# Altium project ZX1541 Interfac in THT.PrjPcb
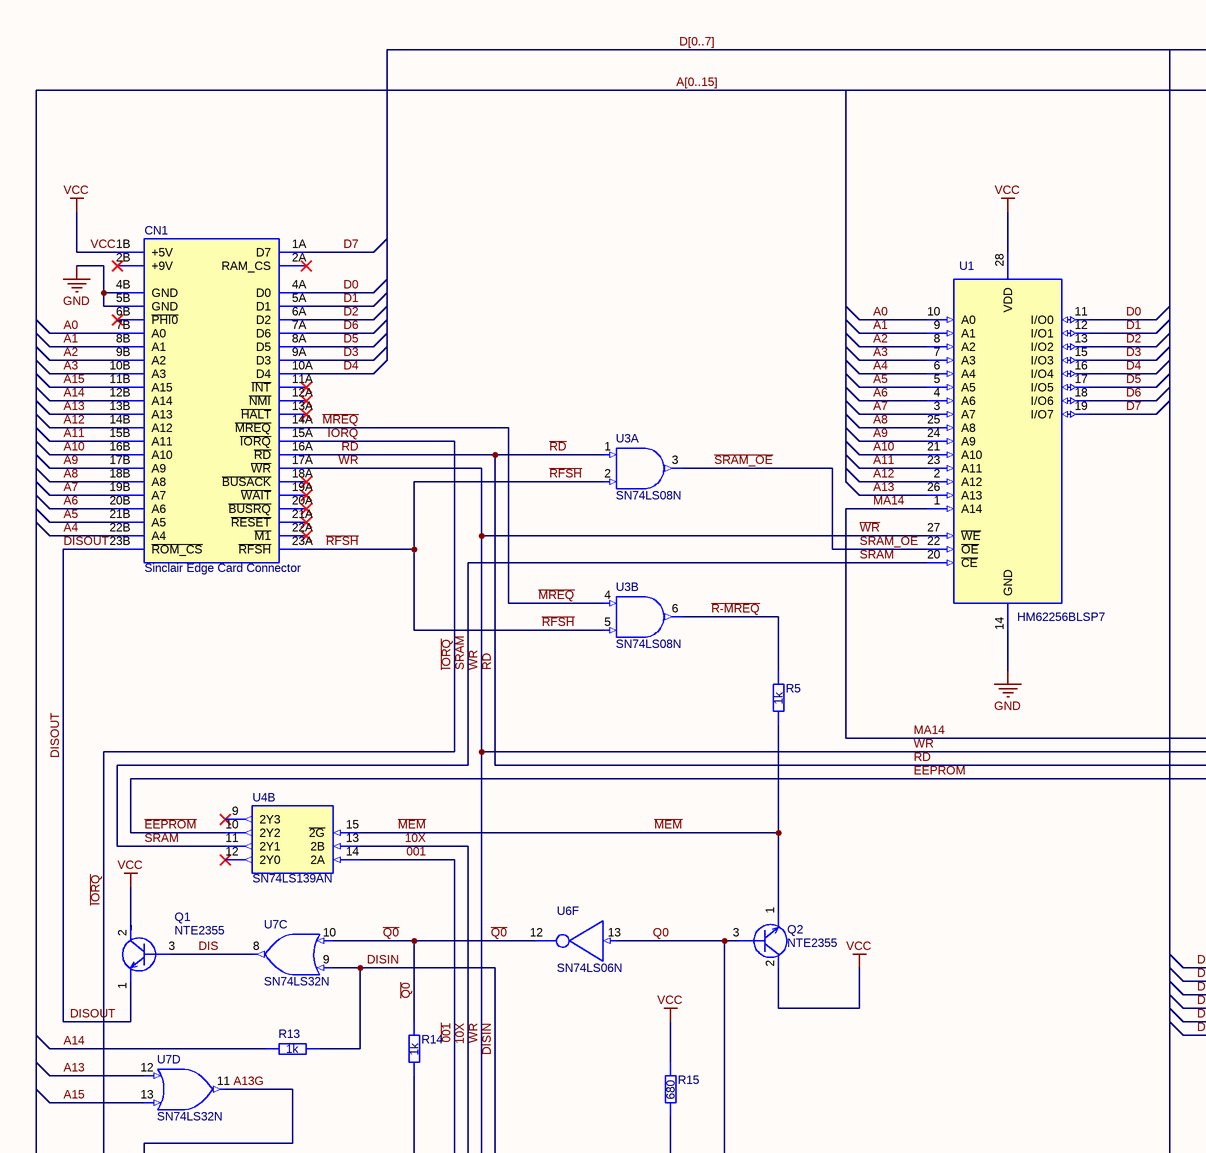
[diagram p0: ZX1541 Interfac in THT.SchDoc, top left]
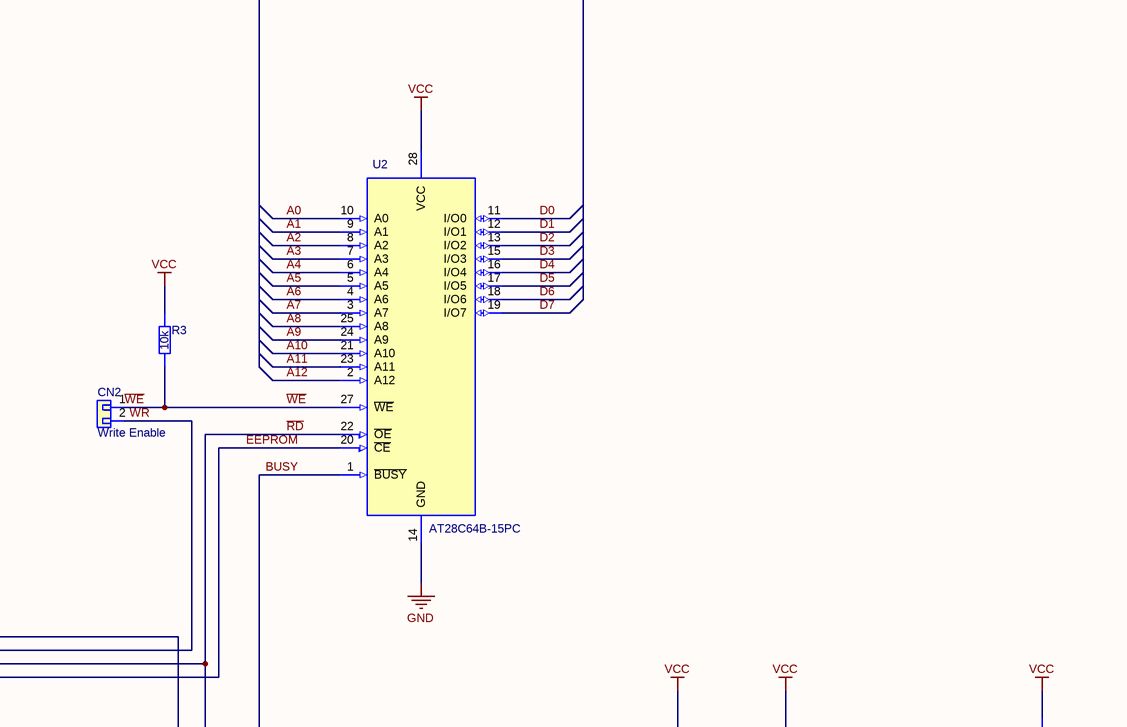
[diagram p1: ZX1541 Interfac in THT.SchDoc, top right]
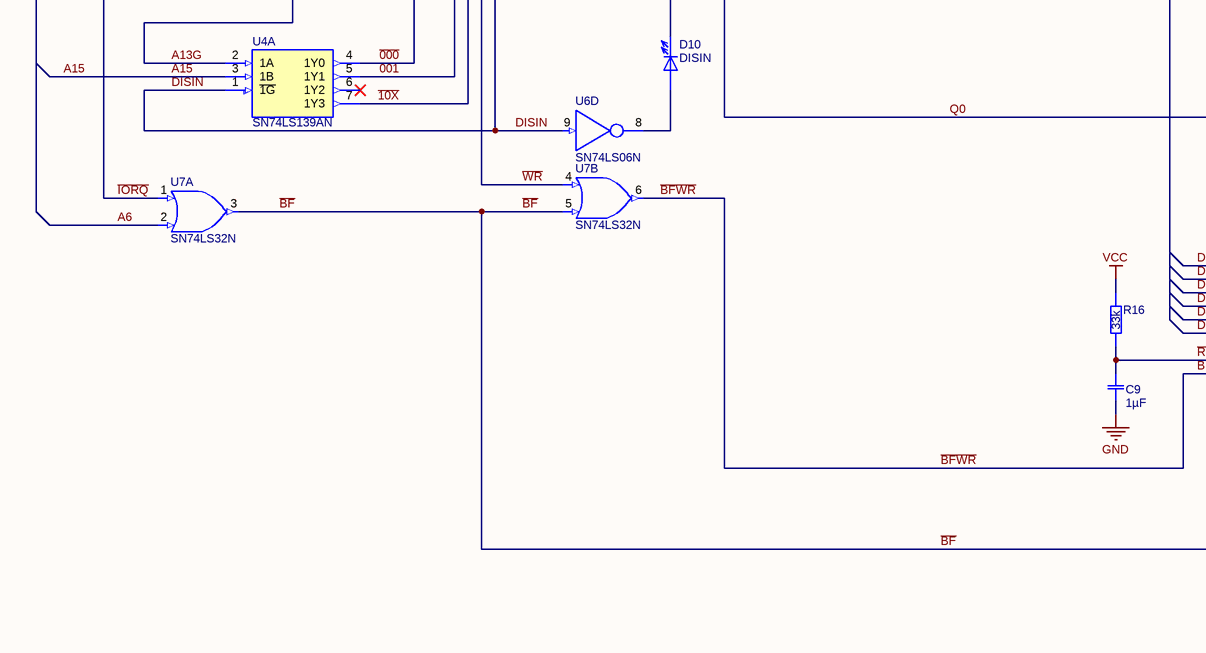
[diagram p2: ZX1541 Interfac in THT.SchDoc, bottom left]
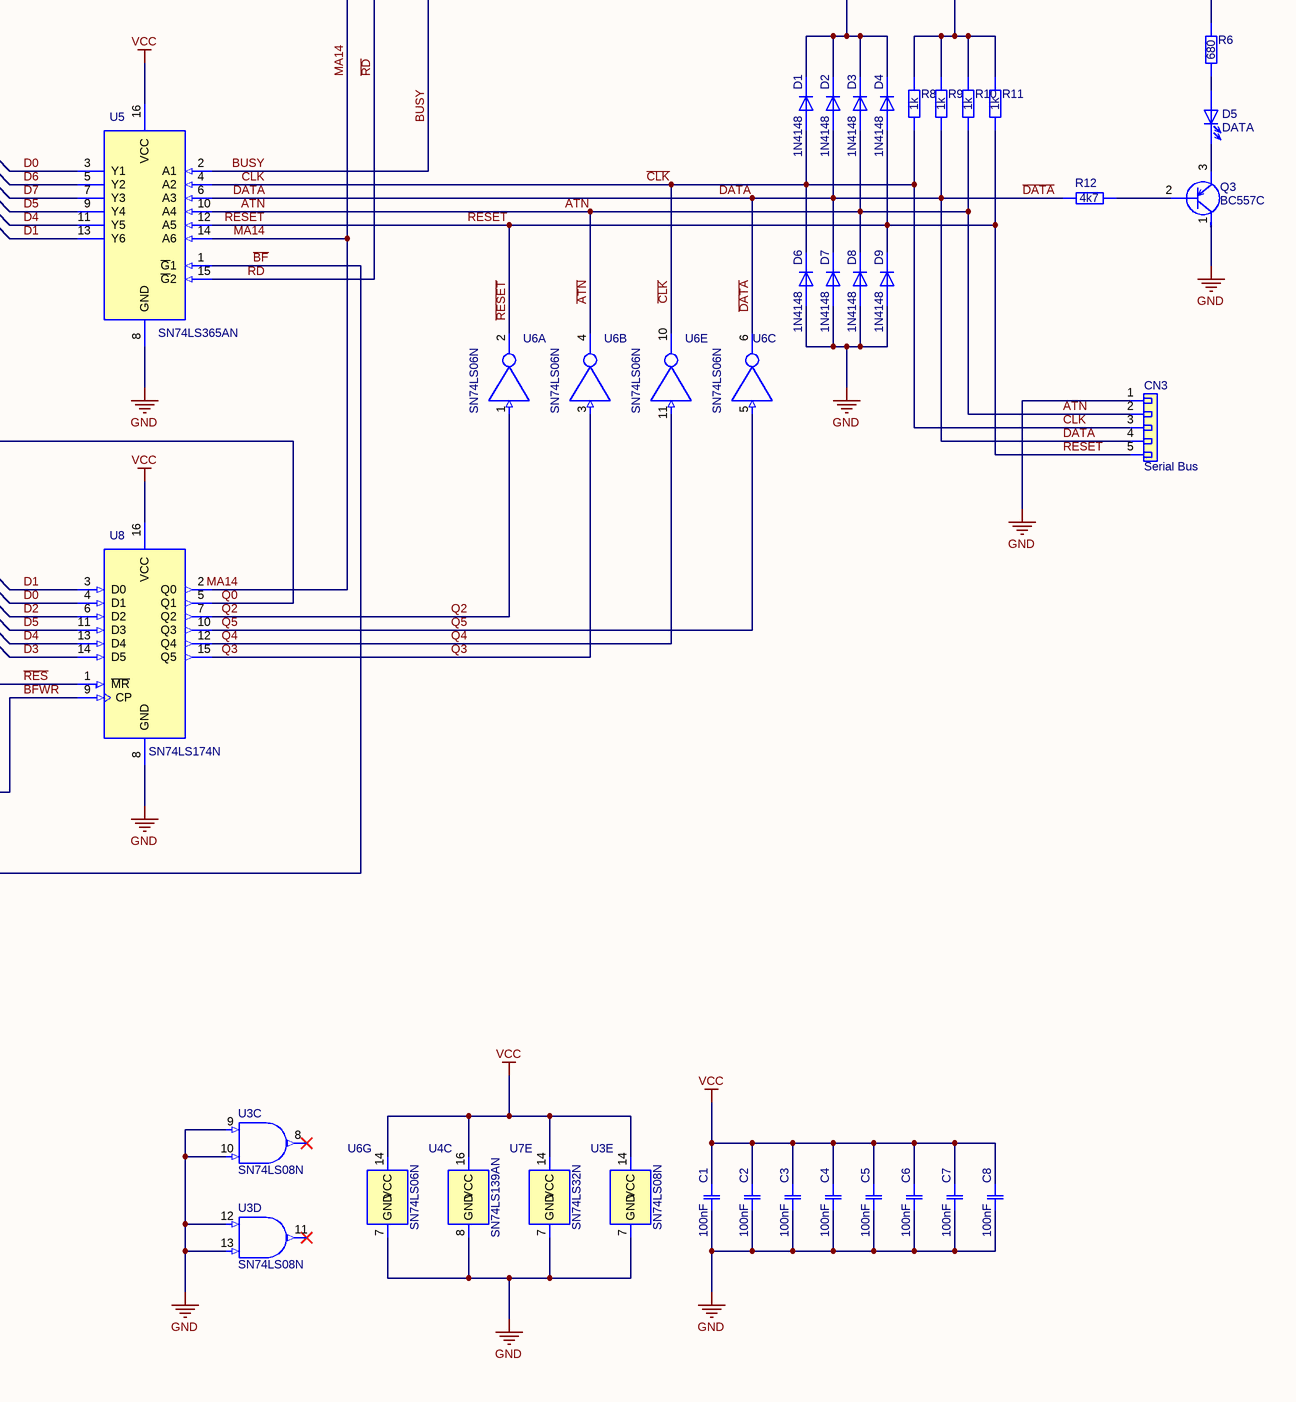
[diagram p3: ZX1541 Interfac in THT.SchDoc, bottom right]
Author: PCB-Tech; Revision: -; Title: Projektname; Version: 1.0
1 sheet, 45 parts. Net scope: global (net labels, ports and power ports of the same name join across sheets).
Board file: ZX1541 Interfac in THT.PcbDoc

## Sheet ZX1541 Interfac in THT.SchDoc: ZX1541 Interface in THT
size 594 x 420 mm; ApprovedBy: .; CheckedBy: .; Author: DiWou; CompanyName: DL2DW; DrawnBy: DiWou; Engineer: .; Organization: DL2DW; DocumentNumber: 1; Revision: -; SheetNumber: 1; SheetTotal: 1; DrawnDate: 11.10.2020; EngrDate: .; ChkdDate: .; Title1: ZX1541 Interface in THT; Title2: for Sinclair ZX-81; Title3: .; Desc1: Version 1.0; Desc2: .; ApprDate: .

### Parts
C1  100nF  [CAP Disc 100nF P2.54mm D5.5mm T3mm]
C2  100nF  [CAP Disc 100nF P2.54mm D5.5mm T3mm]
C3  100nF  [CAP Disc 100nF P2.54mm D5.5mm T3mm]
C4  100nF  [CAP Disc 100nF P2.54mm D5.5mm T3mm]
C5  100nF  [CAP Disc 100nF P2.54mm D5.5mm T3mm]
C6  100nF  [CAP Disc 100nF P2.54mm D5.5mm T3mm]
C7  100nF  [CAP Disc 100nF P2.54mm D5.5mm T3mm]
C8  100nF  [CAP Disc 100nF P2.54mm D5.5mm T3mm]
C9  1µF  [CAP 1µF C315C105K3R5TA P2.54mm]
CN1  Sinclair Edge Card Connector  [Sinclair Card Connector]
CN2  Write Enable  [Pin Header 01x02 2.54mm Horizontal Male]
CN3  Serial Bus  [01x05 RM2.0 mm Male Pin Header - MPE-Garry 150-1-005-0-S-XS0-0835]
D1  1N4148  [1N4148 P=5.08mm]
D2  1N4148  [1N4148 P=5.08mm]
D3  1N4148  [1N4148 P=5.08mm]
D4  1N4148  [1N4148 P=5.08mm]
D5  DATA  [LED 3mm Red Right Angle 4mm]
D6  1N4148  [1N4148 P=5.08mm]
D7  1N4148  [1N4148 P=5.08mm]
D8  1N4148  [1N4148 P=5.08mm]
D9  1N4148  [1N4148 P=5.08mm]
D10  DISIN  [LED 3mm Green Right Angle 4mm]
Q1  NTE2355  [NTE 2355]
Q2  NTE2355  [NTE 2355]
Q3  BC557C  [BC557C]
R3  10k  [10 kOhm R Axial DIN0207 L6.3mm D2.5mm P7.62mm Horizontal]
R5  1k  [1,0 kOhm R Axial DIN0207 L6.3mm D2.5mm P7.62mm Horizontal]
R6  680  [680 kOhm R Axial DIN0207 L6.3mm D2.5mm P7.62mm Horizontal]
R8  1k  [1,0 kOhm R Axial DIN0207 L6.3mm D2.5mm P7.62mm Horizontal]
R9  1k  [1,0 kOhm R Axial DIN0207 L6.3mm D2.5mm P7.62mm Horizontal]
R10  1k  [1,0 kOhm R Axial DIN0207 L6.3mm D2.5mm P7.62mm Horizontal]
R11  1k  [1,0 kOhm R Axial DIN0207 L6.3mm D2.5mm P7.62mm Horizontal]
R12  4k7  [4,7 kOhm R Axial DIN0207 L6.3mm D2.5mm P7.62mm Horizontal]
R13  1k  [1,0 kOhm R Axial DIN0207 L6.3mm D2.5mm P7.62mm Horizontal]
R14  1k  [1,0 kOhm R Axial DIN0207 L6.3mm D2.5mm P7.62mm Horizontal]
R15  680  [680 kOhm R Axial DIN0207 L6.3mm D2.5mm P7.62mm Horizontal]
R16  33k  [33 kOhm R Axial DIN0207 L6.3mm D2.5mm P7.62mm Horizontal]
U1  HM62256BLSP7  [Hitachi HM62256BLSP-7 SRAM 32kx8]
U2  AT28C64B-15PC  [28C64-150 with precision Socket]
U3  SN74LS08N  [SN74LS08N with Socket]  (parts A,B,C,D,E of 5)
U4  SN74LS139AN  [SN74LS139N with Socket]  (parts A,B,C of 3)
U5  SN74LS365AN  [SN74LS365A with Socket]
U6  SN74LS06N  [SN74LS06N with Socket]  (parts A,B,C,D,E,F,G of 7)
U7  SN74LS32N  [SN74LS32N with Socket]  (parts A,B,C,D,E of 5)
U8  SN74LS174N  [SN74LS174N with Socket]

### Nets
GND: C1.1 C2.1 C3.1 C4.1 C5.1 C6.1 C7.1 C8.1 C9.1 CN1.4B(GND) CN1.5B(GND) CN3.1 D6.2 D7.2 D8.2 D9.2 Q3.1 U1.14(GND) U2.14(GND) U3.7(GND) U3.9(3A) U3.10(3B) U3.12(4A) U3.13(4B) U4.8(GND) U5.8(GND) U6.7(GND) U7.7(GND) U8.8(GND)
VCC: C1.2 C2.2 C3.2 C4.2 C5.2 C6.2 C7.2 C8.2 CN1.1B(+5V) D1.1 D2.1 D3.1 D4.1 Q1.2 Q2.2 R3.2 R6.2 R8.2 R9.2 R10.2 R11.2 R15.2 R16.2 U1.28(VDD) U2.28(VCC) U3.14(VCC) U4.16(VCC) U5.16(VCC) U6.14(VCC) U7.14(VCC) U8.16(VCC)
~{000}: R14.1 U4.4(1Y0)
~{001}: U4.5(1Y1) U4.14(2A)
~{10X}: U4.7(1Y3) U4.13(2B)
A0: CN1.7B(A0) U1.10(A0) U2.10(A0)
A1: CN1.8B(A1) U1.9(A1) U2.9(A1)
A2: CN1.9B(A2) U1.8(A2) U2.8(A2)
A3: CN1.10B(A3) U1.7(A3) U2.7(A3)
A4: CN1.22B(A4) U1.6(A4) U2.6(A4)
A5: CN1.21B(A5) U1.5(A5) U2.5(A5)
A6: CN1.20B(A6) U1.4(A6) U2.4(A6) U7.2(1B)
A7: CN1.19B(A7) U1.3(A7) U2.3(A7)
A8: CN1.18B(A8) U1.25(A8) U2.25(A8)
A9: CN1.17B(A9) U1.24(A9) U2.24(A9)
A10: CN1.16B(A10) U1.21(A10) U2.21(A10)
A11: CN1.15B(A11) U1.23(A11) U2.23(A11)
A12: CN1.14B(A12) U1.2(A12) U2.2(A12)
A13: CN1.13B(A13) U1.26(A13) U7.12(4A)
A13G: U4.2(1A) U7.11(4Y)
A14: CN1.12B(A14) R13.1
A15: CN1.11B(A15) U4.3(1B) U7.13(4B)
~{ATN}: CN3.2 D3.2 D8.1 R10.1 U5.10(A4) U6.4(2Y)
~{BF}: U5.1(~{G}1) U7.3(1Y) U7.5(2B)
~{BFWR}: U7.6(2Y) U8.9(CP)
BUSY: U2.1(~{BUSY}) U5.2(A1)
~{CLK}: CN3.3 D1.2 D6.1 R8.1 U5.4(A2) U6.10(5Y)
D0: CN1.4A(D0) U1.11(I/O0) U2.11(I/O0) U5.3(Y1) U8.4(D1)
D1: CN1.5A(D1) U1.12(I/O1) U2.12(I/O1) U5.13(Y6) U8.3(D0)
D2: CN1.6A(D2) U1.13(I/O2) U2.13(I/O2) U8.6(D2)
D3: CN1.9A(D3) U1.15(I/O3) U2.15(I/O3) U8.14(D5)
D4: CN1.10A(D4) U1.16(I/O4) U2.16(I/O4) U5.11(Y5) U8.13(D4)
D5: CN1.8A(D5) U1.17(I/O5) U2.17(I/O5) U5.9(Y4) U8.11(D3)
D6: CN1.7A(D6) U1.18(I/O6) U2.18(I/O6) U5.5(Y2)
D7: CN1.1A(D7) U1.19(I/O7) U2.19(I/O7) U5.7(Y3)
~{DATA}: CN3.4 D2.2 D7.1 R9.1 R12.1 U5.6(A3) U6.6(3Y)
DIS: Q1.3 U7.8(3Y)
DISIN: R13.2 U4.1(~{1G}) U6.9(4A) U7.9(3A)
DISOUT: CN1.23B(~{ROM_CS}) Q1.1
~{EEPROM}: U2.20(~{CE}) U4.10(2Y2)
~{IORQ}: CN1.15A(~{IORQ}) U7.1(1A)
~{MEM}: Q2.1 R5.1 U4.15(~{2G})
~{MREQ}: CN1.14A(~{MREQ}) U3.4(2A)
MA14: U1.1(A14) U5.14(A6) U8.2(Q0)
Q0: Q2.3 U6.13(6A) U8.5(Q1)
Q2: U6.1(1A) U8.7(Q2)
Q3: U6.3(2A) U8.15(Q5)
Q4: U6.11(5A) U8.12(Q4)
Q5: U6.5(3A) U8.10(Q3)
~{Q0}: R14.2 U6.12(6Y) U7.10(3B)
~{R-MREQ}: R5.2 U3.6(2Y)
~{RD}: CN1.16A(~{RD}) U2.22(~{OE}) U3.1(1A) U5.15(~{G}2)
~{RES}: C9.2 R16.1 U8.1(~{MR})
~{RESET}: CN3.5 D4.2 D9.1 R11.1 U5.12(A5) U6.2(1Y)
~{RFSH}: CN1.23A(~{RFSH}) U3.2(1B) U3.5(2B)
~{SRAM}: U1.20(~{CE}) U4.11(2Y1)
~{SRAM_OE}: U1.22(~{OE}) U3.3(1Y)
~{WE}: CN2.1 R3.1 U2.27(~{WE})
~{WR}: CN1.17A(~{WR}) CN2.2 U1.27(~{WE}) U7.4(2A)
NetD5_1: D5.1 Q3.3
NetD5_2: D5.2 R6.1
NetD10_1: D10.1 R15.1
NetD10_2: D10.2 U6.8(4Y)
NetQ3_2: Q3.2 R12.2

Not connected (* = marked no-connect by the designer): CN1 2A(RAM_CS)* 2B(+9V)* 6B(~{PHI0})* 11A(~{INT})* 12A(~{NMI})* 13A(~{HALT})* 18A(~{BUSACK})* 19A(~{WAIT})* 20A(~{BUSRQ})* 21A(~{RESET})* 22A(~{M1})*; U2 26(N/C); U3 8(3Y)* 11(4Y)*; U4 6(1Y2)* 9(2Y3)* 12(2Y0)*

### Buses and harness runs
bus A[0..15]
bus D[0..7]

### Notes on the sheet
- Drawn by:
- Date
- Size:
- A2
- Rev:
- Engr:
- Chkd:
- Appr:
- File:
- Document No:
- Print Date & Time:
- /
- Sheet
- of

### Library data of the parts
C1-C8 = CMP-Capacitors-Ceramic_Capacitors-00007-4: Ceramic Disc Capacitors 100nF -20%~+80% 50V Through Hole,P=2.54mm RoHS; ComponentLink1URL: https://lcsc.com/product-detail/Others_Dersonic-CC1H104ZA1PD3F5O3000_C353909.html
C9 = CMP-Capacitors-Ceramic_Capacitors-00009-2: Multilayer Ceramic Capacitors MLCC - Leaded 25volts 1uF 10% X7R; Dissipation Factor: 3.5%; Temperature Coefficient: 2.2ppm/°C; Voltage: 25V; Lead Diameter: 0.51mm; Lead/Base Style: Straight; Height: 2.54mm; Package Quantity: 500; Max Operating Temperature: 125°C; Termination: Radial; Width: 0.1inch; Lead Pitch: 0.1inch; Min Operating Temperature: -55°C; Depth: 2.54mm; Height - Seated (Max): 0.21inch; Voltage Rating (DC): 25V; Length: 0.15inch; Voltage Rating: 25V; Case/Package: Radial; Tolerance: 10%; Dielectric: X7R; Capacitance: 1uF; Packaging: Bulk; Mount: Through Hole,PCB; Dielectric Material: Ceramic
CN1 = CMP-Connectors-00027-6
CN2 = CMP-Connectors-Male_PIN_Headers-00001-4: CONN HEADER .100" SNGL STR 2POS; Number of Positions: 2; Pitch: 0.1inch; Connector Type: Male Pin; Color: Black; Package Quantity: 1; Mount: Through Hole; Contact Plating: Gold; Contact Mating Length: 0.318inch; Termination: Solder; Number of Rows: 1; Packaging: Bulk
CN3 = CMP-Male_Pin_Headers-RM2.0_Male_Pin_Headers-00003-2: Conn Unshrouded Header HDR 5 POS 2mm Solder ST Thru-Hole Automotive Bulk; Gender: Male; Number of Contacts: 5; Max Voltage Rating (AC): 500V; Min Operating Temperature: -55°C; Lead Free: Lead Free; Housing Material: Polymer; Radiation Hardening: No; Max Operating Temperature: 125°C; Housing Color: Black; Termination: Solder; Contact Plating: Gold; Number of Rows: 1; Packaging: Bulk; Contact Material: Bronze; Pitch: 2mm; Depth: 1.97mm; Orientation: Straight; Length: 10mm
D1-D4 D6-D9 = CMP-Diodes-00002-4: NEXPERIA - 1N4148 - DIODE, 1N4148 AMMO-BOX 10K; Reverse Recovery Time: 4ns; Capacitance: 4pF; Element Configuration: Single; Current: 4A; Output Current: 200mA; Voltage Rating (DC): 100V; Max Power Dissipation: 500mW; Polarity: Standard; Forward Voltage: 1V; Weight: 0.01lb; Lead Free: Lead Free; Length: 2.5inch; Termination: Axial; Voltage: 100V; Forward Current: 200mA; Width: 0.25inch; Packaging: Ammo Pack; Max Repetitive Reverse Voltage (Vrrm): 100V; Max Operating Temperature: 200°C; Number of Pins: 2; Case/Package: SOD; Max Forward Surge Current (Ifsm): 4A; Height: 0.25inch; Peak Non-Repetitive Surge Current: 4A; Radiation Hardening: No; REACH SVHC: No SVHC; Current Rating: 200mA; Min Operating Temperature: -65°C
D5 = CMP-LEDs-00000-4: WURTH ELEKTRONIK   151033RS03000   LED, 3MM,  RED, 2600MCD, 621NM; Test Current: 20mA; Lens Style: Clear,Circular,Round; Forward Voltage: 2V; Viewing Angle: 30°; Forward Current: 30mA; Packaging: Bulk; Color: Red; Package Quantity: 1; Mount: Through Hole; Luminous Intensity: 2600mcd; Wavelength: 621nm; Lens Size: 3mm; Dominant Wavelength: 621nm; Case/Package: Radial; Min Operating Temperature: -40°C; REACH SVHC: Unknown; Max Operating Temperature: 85°C; Height: 5.55mm
D10 = CMP-LEDs-00007-1: WURTH ELEKTRONIK - 151033GS03000 - LED, Green, T-1 (3mm), 530 nm, 3.2 V, 30 mA, 15 cd RoHS Compliant: Yes; Forward Voltage: 3.2V; Luminous Intensity: 15000mcd; Lens Style: Clear,Round,Circular; Wavelength: 530nm; Viewing Angle: 30°; Forward Current: 30mA; Test Current: 20mA; Mount: Through Hole; Package Quantity: 1; Case/Package: Radial; Max Operating Temperature: 85°C; Color: Green; REACH SVHC: Unknown; Height: 5.55mm; Lens Size: 3mm; Min Operating Temperature: -40°C; Packaging: Bulk; Dominant Wavelength: 530nm
Q1 Q2 = CMP-Transistors-00009-1: PRE-BIASED DIG TRANSISTOR, 50V, TO-92; Transistor Polarity:NPN; Collector Emitter Voltage V(br)ceo:50V; Transition Frequency ft:250MHz; Power Dissipation Pd:300mW; DC Collector Current:100mA; DC Current Gain hFE:50; No. of Pins:3 ;RoHS Compliant: Yes; Power Dissipation: 300mW; Element Configuration: Single; Polarity: NPN; Transition Frequency: 250MHz; Max Collector Current: 200mA; Number of Pins: 3; Mount: Through Hole; Max Operating Temperature: 150°C; Weight: 0.016lb; Height: 0.5inch; REACH SVHC: No SVHC; Length: 6inch; Collector Emitter Breakdown Voltage: 50V; Width: 3inch; Collector Emitter Voltage (VCEO): 50V; Max Power Dissipation: 300mW; Min Operating Temperature: -55°C; Collector Base Voltage (VCBO): 50V; Case/Package: TO-92
Q3 = CMP-Transistors-00003-1: Trans GP BJT PNP 45V 0.1A Automotive 3-Pin TO-92 T/R; Number of Elements: 1; Frequency: 150MHz; Emitter Base Voltage (VEBO): 5V; Power Dissipation: 500mW; Collector Base Voltage (VCBO): 50V; Max Operating Temperature: 150°C; Case/Package: TO-92; Collector Emitter Voltage (VCEO): 45V; Packaging: Tape and Reel; Min Operating Temperature: -55°C; Polarity: PNP; Mount: Through Hole; Number of Pins: 3
R3 = CMP-Resistors-Yageo_THT_DIN_0207-00096-1: RES 10K OHM 1/4W 5% AXIAL; Resistance: 10kR; Temperature Coefficient: 500ppm/°C; Max Power Dissipation: 250mW; Case/Package: Axial; Number of Terminations: 2; Composition: Carbon Film; Packaging: Bulk; Min Operating Temperature: -55°C; Lead Free: Lead Free; Package Quantity: 200; Max Operating Temperature: 155°C; Length: 0.248inch; Tolerance: 5%
R5 R8-R11 R13 R14 = CMP-Resistors-Yageo_THT_DIN_0207-00072-1: RES 1K OHM 1/4W 5% AXIAL; Max Power Dissipation: 250mW; Resistance: 1kR; Temperature Coefficient: 500ppm/°C; Composition: Carbon Film; Lead Free: Lead Free; Case/Package: Axial; Packaging: Bulk; Length: 0.248inch; Min Operating Temperature: -55°C; Tolerance: 5%; Number of Terminations: 2; Package Quantity: 200; Max Operating Temperature: 155°C; Power Rating: 250mW
R6 R15 = CMP-Resistors-Yageo_THT_DIN_0207-00140-1: Res 680K Ohm 1/4W 5% Axial; Resistance: 680kR; Max Power Dissipation: 250mW; Temperature Coefficient: -700ppm/°C; Package Quantity: 200; Composition: Carbon Film; Max Operating Temperature: 155°C; Packaging: Bulk; Number of Terminations: 2; Min Operating Temperature: -55°C; Length: 0.248inch; Case/Package: Axial; Tolerance: 5%
R12 = CMP-Resistors-Yageo_THT_DIN_0207-00088-1: RES 4.7K OHM 1/4W 5% AXIAL; Resistance: 4.7kR; Max Power Dissipation: 250mW; Temperature Coefficient: 500ppm/°C; Length: 0.248inch; Number of Terminations: 2; Composition: Carbon Film; Packaging: Bulk; Max Operating Temperature: 155°C; Package Quantity: 200; Case/Package: Axial; Tolerance: 5%; Min Operating Temperature: -55°C; Power Rating: 250mW; Lead Free: Lead Free
R16 = CMP-Resistors-Yageo_THT_DIN_0207-00108-1: RES 33K OHM 1/4W 5% AXIAL; Temperature Coefficient: 500ppm/°C; Max Power Dissipation: 250mW; Resistance: 33kR; Max Operating Temperature: 155°C; Tolerance: 5%; Min Operating Temperature: -55°C; Package Quantity: 200; Case/Package: Axial; Packaging: Bulk; Number of Terminations: 2; Length: 0.248inch; Composition: Carbon Film
U1 = CMP-ICs-Memory-00014-1: Contact for details; Case/Package: PDIP
U2 = CMP-ICs-Memory-00010-3: IC EEPROM 64KBIT 150NS 28DIP; Memory Size: 64Kb; Interface: SPI,Parallel; Max Supply Voltage: 5.5V; Frequency: 150GHz; Min Supply Voltage: 4.5V; Nominal Supply Current: 40mA; Lead Free: Contains Lead; Packaging: Rail/Tube; Min Operating Temperature: 0°C; Density: 64Kb; Memory Type: EEPROM; Max Operating Temperature: 70°C; Number of Pins: 28; Mount: Through Hole; Package Quantity: 14; Case/Package: PDIP; Access Time: 150ns
U3 = CMP-ICs-74xx-series-00004-2: IC GATE AND 4CH 2-INP 14DIP; Low Level Output Current: 8mA; Number of Circuits: 4; Number of Outputs: 1; Schmitt Trigger Input: No; Quiescent Current: 4.4mA; Min Supply Voltage: 4.75V; Number of Input Lines: 2; High Level Output Current: -400uA; Max Supply Voltage: 5.25V; Turn-On Delay Time: 25ns; Operating Supply Voltage: 5V; Propagation Delay: 20ns; Lead Free: Lead Free; Number of Gates: 4; Termination: Through Hole; Height: 4.57mm; Number of Elements: 4; Width: 6.35mm; Logic Function: AND; Weight: 0.032734oz; Max Operating Temperature: 70°C; Number of Bits: 4; Number of Inputs: 2; Number of Output Lines: 1; Packaging: Rail/Tube; Case/Package: PDIP; Mount: Through Hole; Max Output Current: 8mA; Package Quantity: 25; Output Current: 8mA; REACH SVHC: No SVHC; Contact Plating: Gold; Radiation Hardening: No; Min Operating Temperature: 0°C; Length: 19.3mm; Number of Pins: 14
U4 = CMP-ICs-74xx-series-00043-5: TEXAS INSTRUMENTS         SN74LS139AN            IC, DECODER/DEMUX, 74LS139; Number of Input Lines: 2; Propagation Delay: 33ns; Polarity: Inverting; Max Supply Voltage: 5.25V; Bandwidth: 35MHz; Operating Supply Voltage: 5V; Number of Output Lines: 4; Low Level Output Current: 8mA; Max Power Dissipation: 200mW; Throw Configuration: DP4T; High Level Output Current: -400uA; Supply Type: Single; Nominal Supply Current: 100uA; Logic Function: Demultiplexer,Decoder; Min Supply Voltage: 4.75V; Turn-On Delay Time: 38ns; Number of Channels: 2; Lead Free: Lead Free; Independent Circuits: 2; Length: 19.3mm; Number of Bits: 4; Number of Inputs: 2; Number of Outputs: 4; Weight: 0.03357oz; Number of Pins: 16; REACH SVHC: No SVHC; Number of Circuits: 2; Packaging: Rail/Tube; Radiation Hardening: No; Package Quantity: 25; Case/Package: PDIP; Max Operating Temperature: 70°C; Height: 4.57mm; Width: 6.35mm; Number of Elements: 2; Mount: Through Hole; Min Operating Temperature: 0°C
U5 = CMP-ICs-74xx-series-00064-1: Buffer/Line Driver 6-CH Non-Inverting 3-ST Bipolar 16-Pin PDIP Tube; Min Supply Voltage: 4.75V; Number of Bits: 6; Schmitt Trigger Input: No; Propagation Delay: 22ns; High Level Output Current: -2.6mA; Operating Supply Voltage: 5V; Low Level Output Current: 24mA; Logic Function: Buffer,Inverting; Number of Elements: 1; Max Supply Voltage: 5.25V; Polarity: Non-Inverting; Max Operating Temperature: 70°C; Number of Input Lines: 6; Case/Package: PDIP; Number of Output Lines: 6; Length: 19.3mm; Number of Bits per Element: 6; Lead Free: Lead Free; Number of Inputs: 6; Height: 4.57mm; Min Operating Temperature: 0°C; REACH SVHC: No SVHC; Turn-On Delay Time: 22ns; Number of Outputs: 6; Number of Channels: 6; Number of Pins: 16; Max Output Current: 24mA; Package Quantity: 25; Termination: Through Hole; Packaging: Rail/Tube; Output Current: 24mA; Mount: Through Hole; Width: 6.35mm
U6 = CMP-ICs-74xx-series-00008-2: IC INVERTER OPEN COL 6CH 14DIP; Turn-On Delay Time: 20ns; Operating Supply Voltage: 5V; Schmitt Trigger Input: No; Number of Circuits: 6; Number of Inputs: 1; Low Level Output Current: 40mA; Polarity: Inverting; High Level Output Current: -250uA; Max Supply Voltage: 5.25V; Logic Function: Buffer,Inverter,Inverting; Min Supply Voltage: 4.75V; Nominal Supply Current: 100uA; Max Operating Temperature: 70°C; Height: 4.57mm; Radiation Hardening: No; Mount: Through Hole; Number of Pins: 14; Min Operating Temperature: 0°C; Termination: Through Hole; Case/Package: PDIP; Number of Outputs: 6; Lead Free: Lead Free; Number of Elements: 6; Packaging: Rail/Tube; Number of Output Lines: 6; REACH SVHC: No SVHC; Length: 19.3mm; Number of Channels: 6; Propagation Delay: 20ns; Number of Gates: 6; Number of Bits: 6; Number of Input Lines: 6; Width: 6.35mm; Package Quantity: 25
U7 = CMP-ICs-74xx-series-00063-1: Texas Instruments SN74LS32N, Quad 2-Input OR Logic Gate, 4.75  5.25 V, 14-Pin PDIP; Output Type: TTL; Logic Function: OR GATE; Max Supply Voltage: 5.25V; Number of Elements: 4; Min Supply Voltage: 4.75V; Output Current: 8mA; Propagation Delay: 22ns; Nominal Supply Current: 100uA; Number of Input Lines: 2; Number of Output Lines: 1; High Level Output Current: -400uA; Operating Supply Voltage: 5V; Schmitt Trigger Input: No; Quiescent Current: 4.9mA; Weight: 0.032734oz; Termination: Through Hole; Length: 19.3mm; Mount: Through Hole; Package Quantity: 25; Number of Bits: 4; Min Operating Temperature: 0°C; Width: 6.35mm; Turn-On Delay Time: 22ns; Packaging: Rail/Tube; Number of Pins: 14; Number of Outputs: 1; Low Level Output Current: 8mA; Case/Package: PDIP; Lead Free: Lead Free; Number of Inputs: 2; Radiation Hardening: No; REACH SVHC: No SVHC; Number of Circuits: 4; Height: 4.57mm; Number of Gates: 4; Contact Plating: Gold; Max Operating Temperature: 70°C
U8 = CMP-ICs-74xx-series-00057-1: Flip Flop D-Type Bus Interface Pos-Edge 1-Element 16-Pin PDIP Tube; Number of Elements: 1; Number of Circuits: 7; Number of Output Lines: 2; Polarity: Non-Inverting; Output Current: 8mA; Operating Supply Voltage: 5V; Number of Bits per Element: 6; Output Type: TTL; Frequency: 40MHz; Turn-On Delay Time: 20ns; Clock Edge Trigger Type: Positive Edge; Logic Function: D-Type,Flip-Flop; Min Supply Voltage: 4.75V; Propagation Delay: 30ns; Max Supply Voltage: 5.25V; High Level Output Current: -400uA; Package Quantity: 25; Packaging: Rail/Tube; Length: 19.3mm; Number of Input Lines: 2; Radiation Hardening: No; Case/Package: PDIP; Mount: Through Hole; Max Operating Temperature: 70°C; Number of Bits: 6; Lead Free: Lead Free; Height: 4.57mm; Low Level Output Current: 8mA; Max Frequency: 40MHz; REACH SVHC: No SVHC; Weight: 0.03357oz; Width: 6.35mm; Number of Pins: 16; Min Operating Temperature: 0°C